# EAGLE schematic tdr (EAGLE 9.6.2)
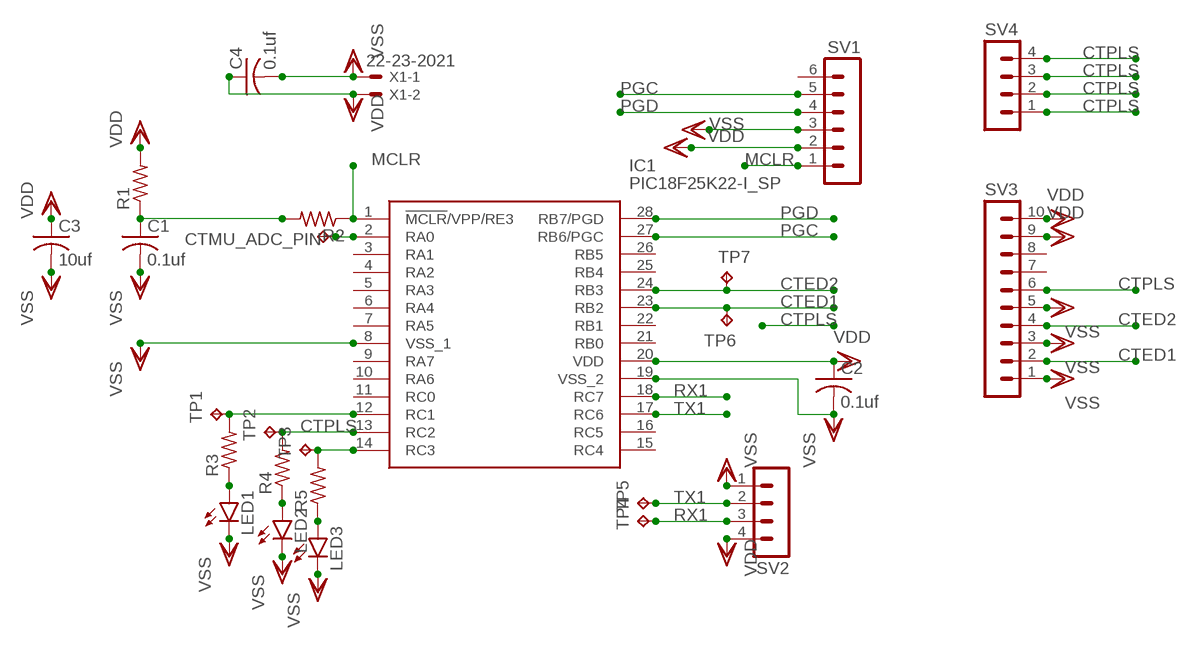
[diagram p0: schematic, sheet 1]

## Parts
C1  0.1uf  C-USC0805  [C0805]
C2  0.1uf  C-USC0805  [C0805]
C3  10uf  C-USC0805  [C0805]
C4  0.1uf  C-USC0805  [C0805]
CTMU_ADC_PIN  TPB1,27  [B1,27]
IC1  PIC18F25K22-I_SP  [DIP794W56P254L3486H508Q28N]
LED1  LEDCHIP-LED0805  [CHIP-LED0805]
LED2  LEDCHIP-LED0805  [CHIP-LED0805]
LED3  LEDCHIP-LED0805  [CHIP-LED0805]
R1  R-US_M0805  [M0805]
R2  R-US_M0805  [M0805]
R3  R-US_M0805  [M0805]
R4  R-US_M0805  [M0805]
R5  R-US_M0805  [M0805]
SV1  MA06-1  [MA06-1]
SV2  MA04-1  [MA04-1]
SV3  MA10-1  [MA10-1]
SV4  MA04-1  [MA04-1]
TP1  TPPAD1-13  [P1-13]
TP2  TPPAD1-13  [P1-13]
TP3  TPPAD1-13  [P1-13]
TP4  TPPAD1-13  [P1-13]
TP5  TPPAD1-13  [P1-13]
TP6  TPPAD1-13  [P1-13]
TP7  TPPAD1-13  [P1-13]
X1  22-23-2021  [22-23-2021]

## Nets
CTED1 [icurrent]: IC1.23(RB2) SV3.2 TP6.TP
CTED2 [icurrent]: IC1.24(RB3) SV3.4 TP7.TP
CTPLS [icurrent]: IC1.13(RC2) R4.2 SV3.6 SV4.1 SV4.2 SV4.3 SV4.4 TP2.TP
MCLR: IC1.1(!MCLR!/VPP/RE3) R2.1 SV1.1
N$1: C1.1 R1.1 R2.2
N$2: IC1.12(RC1) R3.2 TP1.TP
N$3: CTMU_ADC_PIN.TP IC1.2(RA0)
N$4: IC1.14(RC3) R5.2 TP3.TP
N$5: LED1.A R3.1
N$6: LED2.A R4.1
N$7: LED3.A R5.1
PGC: IC1.27(RB6/PGC) SV1.5
PGD: IC1.28(RB7/PGD) SV1.4
RX1: IC1.18(RC7) SV2.3 TP4.TP
TX1: IC1.17(RC6) SV2.2 TP5.TP
VDD [icurrent]: C2.1 C3.1 C4.1 IC1.20(VDD) R1.2 SV1.2 SV2.4 SV3.9 SV3.10 X1.2
VSS [icurrent]: C1.2 C2.2 C3.2 C4.2 IC1.8(VSS_1) IC1.19(VSS_2) LED1.C LED2.C LED3.C SV1.3 SV2.1 SV3.1 SV3.3 SV3.5 X1.1
Unconnected: IC1.3(RA1) IC1.4(RA2) IC1.5(RA3) IC1.6(RA4) IC1.7(RA5) IC1.9(RA7) IC1.10(RA6) IC1.11(RC0) IC1.15(RC4) IC1.16(RC5) IC1.21(RB0) IC1.22(RB1) IC1.25(RB4) IC1.26(RB5) SV1.6 SV3.7 SV3.8

## Library data of the parts
C1-C4 = rcl:C-US: CAPACITOR, American symbol; SPICEPREFIX: C
CTMU_ADC_PIN TP1-TP7 = testpad:TP: Test pad
IC1 = PIC18F25K22-I_SP:PIC18F25K22-I_SP: MCU 8-Bit PIC18 32KB Flash XLP SPDIP28 Microchip PIC18F25K22-I/SP, 8bit PIC Microcontroller, 64MHz, 32 kB Flash, 28-Pin PDIP Source: Datasheet <http://ww1.microchip.com/downloads/en/DeviceDoc/40001412G.pdf>; DESCRIPTION: MCU 8-Bit PIC18 32KB Flash XLP SPDIP28 Microchip PIC18F25K22-I/SP, 8bit PIC Microcontroller, 64MHz, 32 kB Flash, 28-Pin PDIP; HEIGHT: 5.08mm; MANUFACTURER_NAME: Microchip; MANUFACTURER_PART_NUMBER: PIC18F25K22-I/SP; MOUSER_PART_NUMBER: 579-PIC18F25K22ISP; MOUSER_PRICE-STOCK: https://www.mouser.co.uk/ProductDetail/Microchip-Technology/PIC18F25K22-I-SP?qs=RXaOwepKlZ25c3%2FxinGXiw%3D%3D
LED1-LED3 = led:LED: LED OSRAM: - CHIPLED LG R971, LG N971, LY N971, LG Q971, LY Q971, LO R971, LY R971 LH N974, LH R974 LS Q976, LO Q976, LY Q976 LO Q996 - Hyper CHIPLED LW Q18S LB Q993, LB Q99A, LB R99A - SideLED LS A670, LO A670, LY A670, LG A670, LP A670 LB A673, LV A673, LT A673, LW A673 LH A674 LY A675 LS A676, LA A676, LO A676, LY A676, LW A676 LS A679, LY A679, LG A679 - Hyper Micro SIDELED® LS Y876, LA Y876, LO Y876, LY Y876 LT Y87S - SmartLED LW L88C, LW L88S LB L89C, LB L89S, LG L890 LS L89K, LO L89K, LY L89K LS L896, LA L896, LO L896, LY L896 - TOPLED LS T670, LO T670, LY T670, LG T670, LP T670 LSG T670, LSP T670, LSY T670, LOP T670, LYG T670 LG T671, LOG T671, LSG T671 LB T673, LV T673, LT T673, LW T673 LH T674 LS T676, LA T676, LO T676, LY T676, LB T676, LH T676, LSB T676, LW T676 LB T67C, LV T67C, LT T67C, LS T67K, LO T67K, LY T67K, LW E67C LS E67B, LA E67B, LO E67B, LY E67B, LB E67C, LV E67C, LT E67C LW T67C LS T679, LY T679, LG T679 LS T770, LO T770, LY T770, LG T770, LP T770 LB T773, LV T773, LT T773, LW T773 LH T774 LS E675, LA E675, LY E675, LS T675 LS T776, LA T776, LO T776, LY T776, LB T776 LHGB T686 LT T68C, LB T68C - Hyper Mini TOPLED® LB M676 - Mini TOPLED Santana® LG M470 LS M47K, LO M47K, LY M47K Source: http://www.osram.convergy.de LUXEON: - LUMILED® LXK2-PW12-R00, LXK2-PW12-S00, LXK2-PW14-U00, LXK2-PW14-V00 LXK2-PM12-R00, LXK2-PM12-S00, LXK2-PM14-U00 LXK2-PE12-Q00, LXK2-PE12-R00, LXK2-PE12-S00, LXK2-PE14-T00, LXK2-PE14-U00 LXK2-PB12-K00, LXK2-PB12-L00, LXK2-PB12-M00, LXK2-PB14-N00, LXK2-PB14-P00, LXK2-PB14-Q00 LXK2-PR12-L00, LXK2-PR12-M00, LXK2-PR14-Q00, LXK2-PR14-R00 LXK2-PD12-Q00, LXK2-PD12-R00, LXK2-PD12-S00 LXK2-PH12-R00, LXK2-PH12-S00 LXK2-PL12-P00, LXK2-PL12-Q00, LXK2-PL12-R00 Source: www.luxeon.com KINGBRIGHT: KA-3528ASYC Source: www.kingbright.com
R1-R5 = rcl:R-US_: RESISTOR, American symbol; SPICEPREFIX: R
SV1 = con-lstb:MA06-1: PIN HEADER; OC_FARNELL: unknown; OC_NEWARK: unknown
SV2 SV4 = con-lstb:MA04-1: PIN HEADER; OC_FARNELL: unknown; OC_NEWARK: unknown
SV3 = con-lstb:MA10-1: PIN HEADER; OC_FARNELL: unknown; OC_NEWARK: unknown
X1 = con-molex:22-23-2021: .100" (2.54mm) Center Header - 2 Pin; MF: MOLEX; MPN: 22-23-2021; OC_FARNELL: 1462926; OC_NEWARK: 25C3832

## Net classes
1 icurrent: width 0.305 mm